# Altium project Pneumatics_Board.PrjPcb
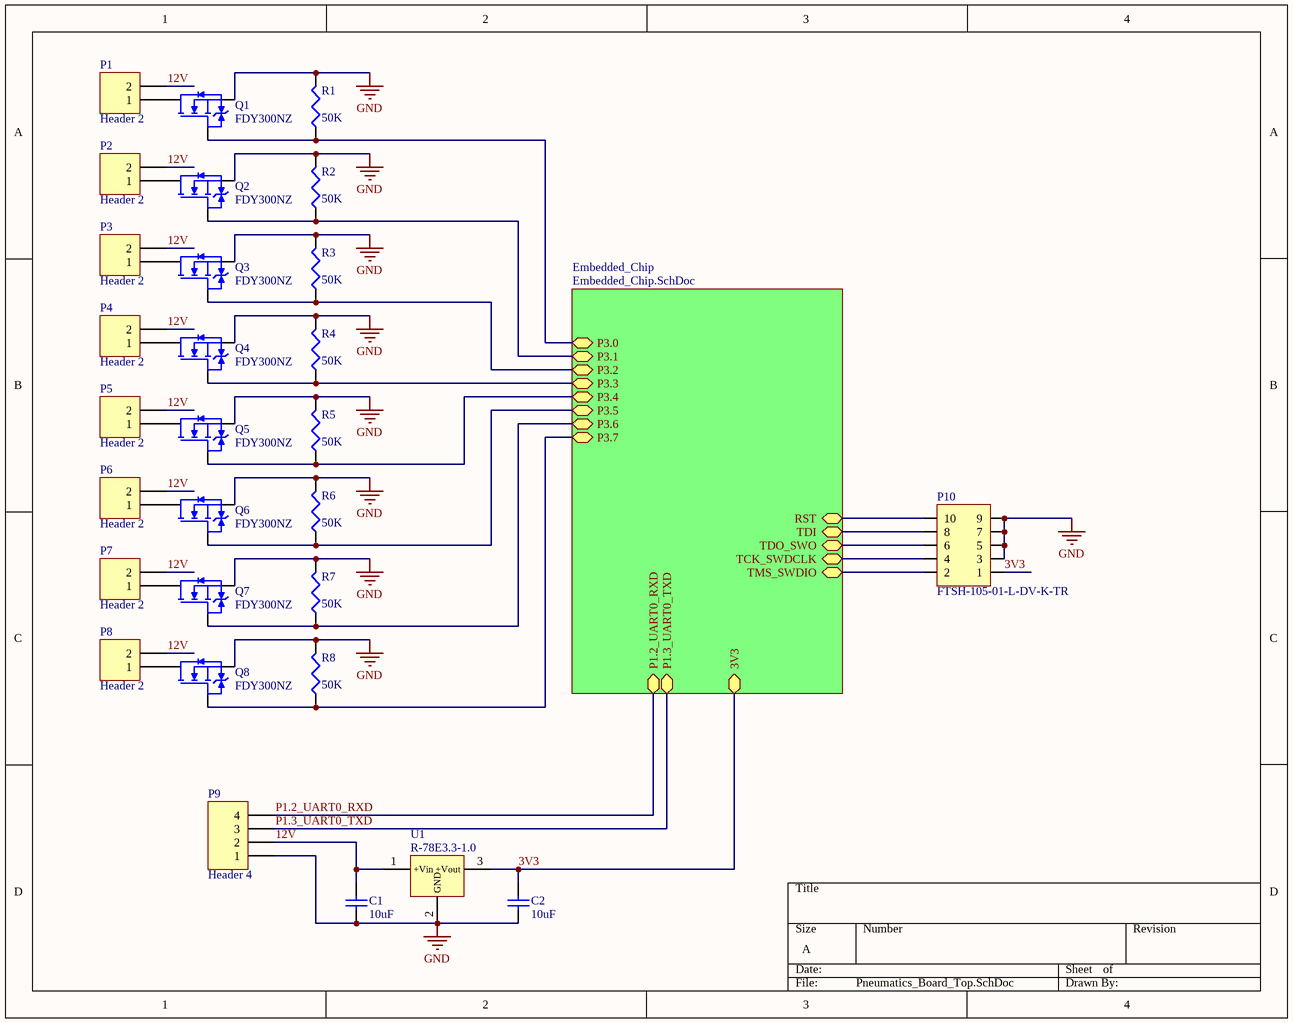
[diagram p0: Pneumatics_Board_Top.SchDoc]
2 sheets, 53 parts. Net scope: hierarchical (ports join the sheet entries above them; power ports are global).
Board file: Pneumatics_Board.PcbDoc
Sheets:
  Pneumatics_Board_Top.SchDoc
    Embedded_Chip = Embedded_Chip.SchDoc

## Sheet Pneumatics_Board_Top.SchDoc
size A

### Parts
C1  value 10uF  [C1206]  (hidden comment: Cap Semi)
C2  value 10uF  [C1206]  (hidden comment: Cap Semi)
P1  Header 2  [HDR1X2]
P2  Header 2  [HDR1X2]
P3  Header 2  [HDR1X2]
P4  Header 2  [HDR1X2]
P5  Header 2  [HDR1X2]
P6  Header 2  [HDR1X2]
P7  Header 2  [HDR1X2]
P8  Header 2  [HDR1X2]
P9  Header 4  [HDR1X4]
P10  FTSH-105-01-L-DV-K-TR  [FTSH-105-01-L-DV-K-TR]
Q1  FDY300NZ  [FDY300NZ]
Q2  FDY300NZ  [FDY300NZ]
Q3  FDY300NZ  [FDY300NZ]
Q4  FDY300NZ  [FDY300NZ]
Q5  FDY300NZ  [FDY300NZ]
Q6  FDY300NZ  [FDY300NZ]
Q7  FDY300NZ  [FDY300NZ]
Q8  FDY300NZ  [FDY300NZ]
R1  value 50K  [J1-0603]  (hidden comment: Res3)
R2  value 50K  [J1-0603]  (hidden comment: Res3)
R3  value 50K  [J1-0603]  (hidden comment: Res3)
R4  value 50K  [J1-0603]  (hidden comment: Res3)
R5  value 50K  [J1-0603]  (hidden comment: Res3)
R6  value 50K  [J1-0603]  (hidden comment: Res3)
R7  value 50K  [J1-0603]  (hidden comment: Res3)
R8  value 50K  [J1-0603]  (hidden comment: Res3)
U1  R-78E3.3-1.0  [R-78Exx-1.0]

### Sub-sheets
Embedded_Chip = Embedded_Chip.SchDoc: 3V3, TMS_SWDIO, TCK_SWDCLK, TDO_SWO, TDI, RST, P3.0, P3.1, P3.2, P3.3, P3.4, P3.5, P3.6, P3.7, P1.2_UART0_RXD, P1.3_UART0_TXD

### Nets
GND: C1.1 C2.1 P9.1 P10.3 P10.5 P10.7 P10.9 Q1.2(Source) Q2.2(Source) Q3.2(Source) Q4.2(Source) Q5.2(Source) Q6.2(Source) Q7.2(Source) Q8.2(Source) R1.2 R2.2 R3.2 R4.2 R5.2 R6.2 R7.2 R8.2 U1.2(GND)
3V3: C2.2 P10.1 U1.3(+Vout) ; sheet Embedded_Chip/3V3
12V: C1.2 P1.2 P2.2 P3.2 P4.2 P5.2 P6.2 P7.2 P8.2 P9.2 U1.1(+Vin)
P1.2_UART0_RXD: P9.4 ; sheet Embedded_Chip/P1.2_UART0_RXD
P1.3_UART0_TXD: P9.3 ; sheet Embedded_Chip/P1.3_UART0_TXD
P3.0: Q1.1(Gate) R1.1 ; sheet Embedded_Chip/P3.0
P3.1: Q2.1(Gate) R2.1 ; sheet Embedded_Chip/P3.1
P3.2: Q3.1(Gate) R3.1 ; sheet Embedded_Chip/P3.2
P3.3: Q4.1(Gate) R4.1 ; sheet Embedded_Chip/P3.3
P3.4: Q5.1(Gate) R5.1 ; sheet Embedded_Chip/P3.4
P3.5: Q6.1(Gate) R6.1 ; sheet Embedded_Chip/P3.5
P3.6: Q7.1(Gate) R7.1 ; sheet Embedded_Chip/P3.6
P3.7: Q8.1(Gate) R8.1 ; sheet Embedded_Chip/P3.7
RST: P10.10 ; sheet Embedded_Chip/RST
TCK_SWDCLK: P10.4 ; sheet Embedded_Chip/TCK_SWDCLK
TDI: P10.8 ; sheet Embedded_Chip/TDI
TDO_SWO: P10.6 ; sheet Embedded_Chip/TDO_SWO
TMS_SWDIO: P10.2 ; sheet Embedded_Chip/TMS_SWDIO
NetP1_1: P1.1 Q1.3(Drain)
NetP2_1: P2.1 Q2.3(Drain)
NetP3_1: P3.1 Q3.3(Drain)
NetP4_1: P4.1 Q4.3(Drain)
NetP5_1: P5.1 Q5.3(Drain)
NetP6_1: P6.1 Q6.3(Drain)
NetP7_1: P7.1 Q7.3(Drain)
NetP8_1: P8.1 Q8.3(Drain)

### Library data of the parts
C1 C2 = Cap Semi: Capacitor (Semiconductor SIM Model); Published: 8-Jun-2000; LatestRevisionDate: 29-May-2009; LatestRevisionNote: IPC-7351 Footprint Added.; PackageReference: C1206; Publisher: Altium Limited; PackageDescription: Chip Capacitor
P1-P8 = Header 2: Header, 2-Pin; LatestRevisionDate: 17-Jul-2002; LatestRevisionNote: Re-released for DXP Platform.; Publisher: Altium Limited
P9 = Header 4: Header, 4-Pin; LatestRevisionDate: 17-Jul-2002; LatestRevisionNote: Re-released for DXP Platform.; Publisher: Altium Limited
P10 = JTAG Header: CONN HEADER 10POS DUAL .05" SMD; Digikey Link: https://www.digikey.com/product-detail/en/samtec-inc/FTSH-105-01-L-DV-K-TR/SAM13165CT-ND/8827920; Drawings: http://suddendocs.samtec.com/prints/ftsh-1xx-xx-xxx-dv-xxx-xxx-mkt.pdf; Datasheet: http://suddendocs.samtec.com/catalog_english/ftsh_smt.pdf
Q1-Q8 = FDY300NZ: N-Channel 20V 600mA (Ta) 625mW (Ta) Surface Mount SC-89-3; Digikey: https://www.digikey.com/product-detail/en/on-semiconductor/FDY300NZ/FDY300NZCT-ND/1923099; Datasheet: https://www.fairchildsemi.com/datasheets/FD/FDY300NZ.pdf
R1-R8 = Res3: Resistor; Published: 8-Jun-2000; LatestRevisionDate: 29-May-2009; LatestRevisionNote: IPC-7351 Footprint Added.; PackageReference: J1-0603; Publisher: Altium Limited; PackageDescription: Chip Resistor
U1 = R-78Exx-1.0: 1A DC/DC Voltage Converter; Datasheet: https://www.recom-power.com/pdf/Innoline/R-78Exx-1.0.pdf; Digikey: https://www.digikey.com/product-detail/en/recom-power/R-78E3.3-1.0/945-2409-5-ND/5327711

## Sheet Embedded_Chip.SchDoc
size A
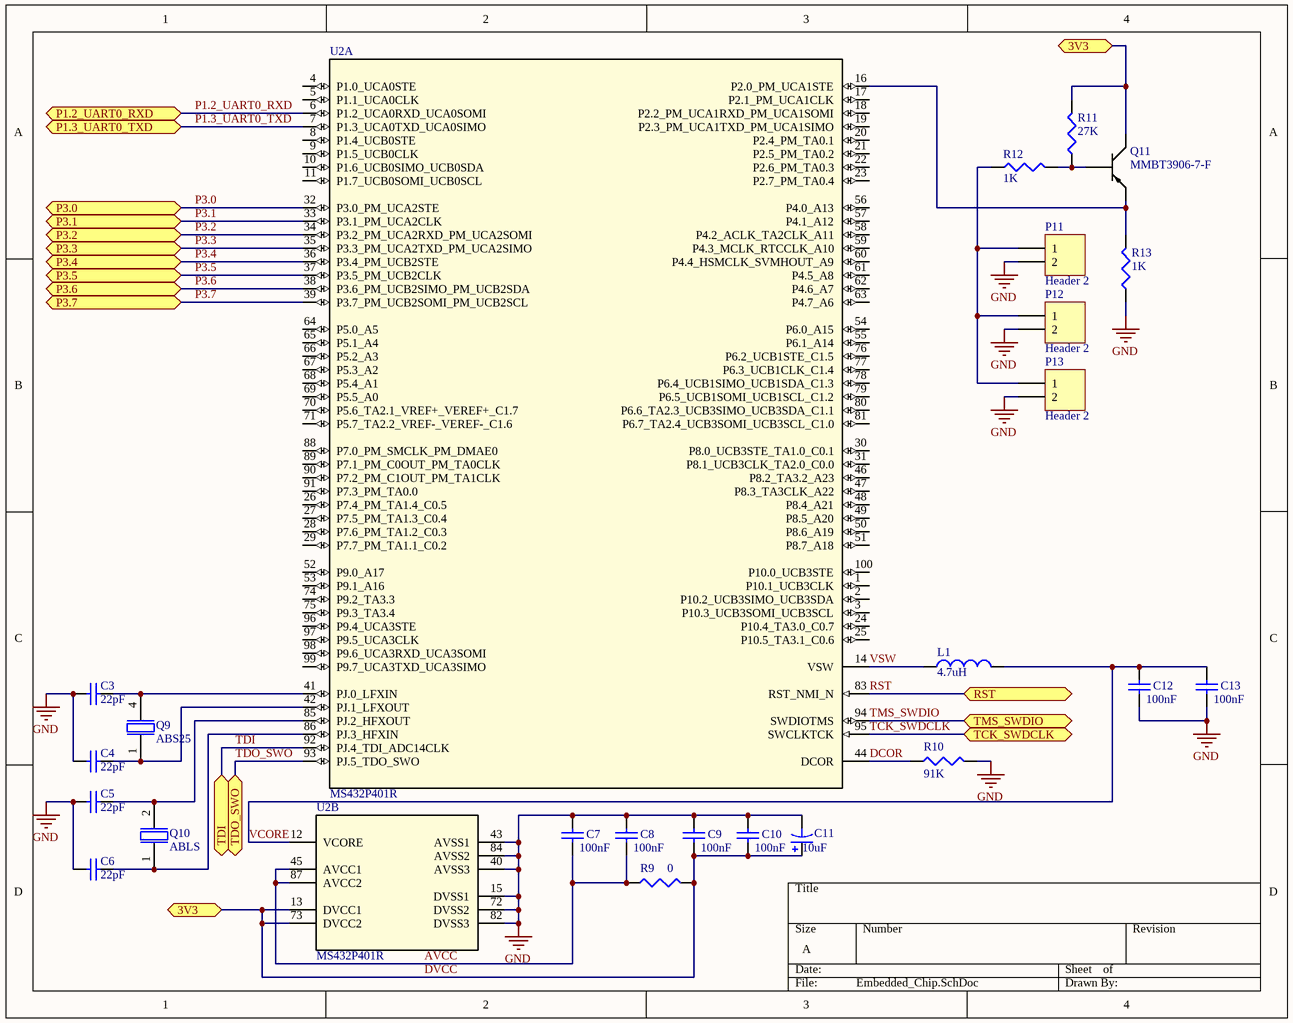
[diagram p1: Embedded_Chip.SchDoc]

### Parts
C3  value 22pF  [C1206]  (hidden comment: Cap Semi)
C4  value 22pF  [C1206]  (hidden comment: Cap Semi)
C5  value 22pF  [C1206]  (hidden comment: Cap Semi)
C6  value 22pF  [C1206]  (hidden comment: Cap Semi)
C7  value 100nF  [C1206]  (hidden comment: Cap Semi)
C8  value 100nF  [C1206]  (hidden comment: Cap Semi)
C9  value 100nF  [C1206]  (hidden comment: Cap Semi)
C10  value 100nF  [C1206]  (hidden comment: Cap Semi)
C11  value 10uF  [CAPAE5043X55M]  (hidden comment: Cap Pol3)
C12  value 100nF  [C1206]  (hidden comment: Cap Semi)
C13  value 100nF  [C1206]  (hidden comment: Cap Semi)
L1  value 4.7uH  [0806 (Metric 2016)]  (hidden comment: Inductor)
P11  Header 2  [HDR1X2]
P12  Header 2  [HDR1X2]
P13  Header 2  [HDR1X2]
Q9  ABS25  [ABS25]
Q10  ABLS  [ABLS]
Q11  MMBT3906-7-F  [MMBT3906-7-F]
R9  value 0  [J1-0603]  (hidden comment: Res3)
R10  value 91K  [J1-0603]  (hidden comment: Res3)
R11  value 27K  [J1-0603]  (hidden comment: Res3)
R12  value 1K  [J1-0603]  (hidden comment: Res3)
R13  value 1K  [J1-0603]  (hidden comment: Res3)
U2  MS432P401R  [PZ0100A_M]  (parts A,B of 2)

### Ports
3V3, P1.2_UART0_RXD, P1.3_UART0_TXD, P3.0, P3.1, P3.2, P3.3, P3.4, P3.5, P3.6, P3.7, RST, TCK_SWDCLK, TDI, TDO_SWO, TMS_SWDIO

### Nets
GND: C3.1 C4.1 C5.1 C6.1 C7.2 C8.2 C9.2 C10.2 C11.2 C12.1 C13.1 P11.2 P12.2 P13.2 R10.2 R13.1 U2.15(DVSS1) U2.40(AVSS3) U2.43(AVSS1) U2.72(DVSS2) U2.82(DVSS3) U2.84(AVSS2)
AVCC: C7.1 C8.1 R9.1 U2.45(AVCC1) U2.87(AVCC2)
DCOR: R10.1 U2.44(DCOR)
DVCC: C9.1 C10.1 C11.1 Q11.C(Collector) R9.2 R11.2 U2.13(DVCC1) U2.73(DVCC2) ; port 3V3  [project net 3V3]
P1.2_UART0_RXD: U2.6(P1.2_UCA0RXD_UCA0SOMI) ; port P1.2_UART0_RXD
P1.3_UART0_TXD: U2.7(P1.3_UCA0TXD_UCA0SIMO) ; port P1.3_UART0_TXD
P3.0: U2.32(P3.0_PM_UCA2STE) ; port P3.0
P3.1: U2.33(P3.1_PM_UCA2CLK) ; port P3.1
P3.2: U2.34(P3.2_PM_UCA2RXD_PM_UCA2SOMI) ; port P3.2
P3.3: U2.35(P3.3_PM_UCA2TXD_PM_UCA2SIMO) ; port P3.3
P3.4: U2.36(P3.4_PM_UCB2STE) ; port P3.4
P3.5: U2.37(P3.5_PM_UCB2CLK) ; port P3.5
P3.6: U2.38(P3.6_PM_UCB2SIMO_PM_UCB2SDA) ; port P3.6
P3.7: U2.39(P3.7_PM_UCB2SOMI_PM_UCB2SCL) ; port P3.7
RST: U2.83(RST_NMI_N) ; port RST
TCK_SWDCLK: U2.95(SWCLKTCK) ; port TCK_SWDCLK
TDI: U2.92(PJ.4_TDI_ADC14CLK) ; port TDI
TDO_SWO: U2.93(PJ.5_TDO_SWO) ; port TDO_SWO
TMS_SWDIO: U2.94(SWDIOTMS) ; port TMS_SWDIO
VCORE: C12.2 C13.2 L1.2 U2.12(VCORE)
VSW: L1.1 U2.14(VSW)
NetC3_2: C3.2 Q9.4 U2.41(PJ.0_LFXIN)
NetC4_2: C4.2 Q9.1 U2.42(PJ.1_LFXOUT)
NetC5_2: C5.2 Q10.2 U2.85(PJ.2_HFXOUT)
NetC6_2: C6.2 Q10.1 U2.86(PJ.3_HFXIN)
NetP11_1: P11.1 P12.1 P13.1 R12.1
NetQ11_B: Q11.B(Body) R11.1 R12.2
NetQ11_E: Q11.E(Emitter) R13.2 U2.16(P2.0_PM_UCA1STE)

Not connected (* = marked no-connect by the designer): U2 1(P10.1_UCB3CLK) 2(P10.2_UCB3SIMO_UCB3SDA) 3(P10.3_UCB3SOMI_UCB3SCL) 4(P1.0_UCA0STE) 5(P1.1_UCA0CLK) 8(P1.4_UCB0STE) 9(P1.5_UCB0CLK) 10(P1.6_UCB0SIMO_UCB0SDA) 11(P1.7_UCB0SOMI_UCB0SCL) 17(P2.1_PM_UCA1CLK) 18(P2.2_PM_UCA1RXD_PM_UCA1SOMI) 19(P2.3_PM_UCA1TXD_PM_UCA1SIMO) 20(P2.4_PM_TA0.1) 21(P2.5_PM_TA0.2) 22(P2.6_PM_TA0.3) 23(P2.7_PM_TA0.4) 24(P10.4_TA3.0_C0.7) 25(P10.5_TA3.1_C0.6) 26(P7.4_PM_TA1.4_C0.5) 27(P7.5_PM_TA1.3_C0.4) 28(P7.6_PM_TA1.2_C0.3) 29(P7.7_PM_TA1.1_C0.2) 30(P8.0_UCB3STE_TA1.0_C0.1) 31(P8.1_UCB3CLK_TA2.0_C0.0) 46(P8.2_TA3.2_A23) 47(P8.3_TA3CLK_A22) 48(P8.4_A21) 49(P8.5_A20) 50(P8.6_A19) 51(P8.7_A18) 52(P9.0_A17) 53(P9.1_A16) 54(P6.0_A15) 55(P6.1_A14) 56(P4.0_A13) 57(P4.1_A12) 58(P4.2_ACLK_TA2CLK_A11) 59(P4.3_MCLK_RTCCLK_A10) 60(P4.4_HSMCLK_SVMHOUT_A9) 61(P4.5_A8) 62(P4.6_A7) 63(P4.7_A6) 64(P5.0_A5) 65(P5.1_A4) 66(P5.2_A3) 67(P5.3_A2) 68(P5.4_A1) 69(P5.5_A0) 70(P5.6_TA2.1_VREF+_VEREF+_C1.7) 71(P5.7_TA2.2_VREF-_VEREF-_C1.6) 74(P9.2_TA3.3) 75(P9.3_TA3.4) 76(P6.2_UCB1STE_C1.5) 77(P6.3_UCB1CLK_C1.4) 78(P6.4_UCB1SIMO_UCB1SDA_C1.3) 79(P6.5_UCB1SOMI_UCB1SCL_C1.2) 80(P6.6_TA2.3_UCB3SIMO_UCB3SDA_C1.1) 81(P6.7_TA2.4_UCB3SOMI_UCB3SCL_C1.0) 88(P7.0_PM_SMCLK_PM_DMAE0) 89(P7.1_PM_C0OUT_PM_TA0CLK) 90(P7.2_PM_C1OUT_PM_TA1CLK) 91(P7.3_PM_TA0.0) 96(P9.4_UCA3STE) 97(P9.5_UCA3CLK) 98(P9.6_UCA3RXD_UCA3SOMI) 99(P9.7_UCA3TXD_UCA3SIMO) 100(P10.0_UCB3STE)

### Library data of the parts
C3-C10 C12 C13 = Cap Semi: Capacitor (Semiconductor SIM Model); Published: 8-Jun-2000; LatestRevisionDate: 29-May-2009; LatestRevisionNote: IPC-7351 Footprint Added.; PackageReference: C1206; Publisher: Altium Limited; PackageDescription: Chip Capacitor
C11 = Cap Pol3: 10µF 10V Aluminum Electrolytic Capacitors Radial, Can - SMD 1000 Hrs @ 85°C; Digikey: https://www.digikey.com/product-detail/en/wurth-electronics-inc/865090240001/732-8394-1-ND/5728351
L1 = Inductor: Code_IEC: 1005; Published: 8-Jun-2000; LatestRevisionDate: 29-May-2009; LatestRevisionNote: IPC-7351 Footprint Added.; PackageReference: 0402-A; Publisher: Altium Limited; PackageDescription: Chip Inductor; Code_JEITA: 0402; Supplier 1: Digi-Key; Supplier Part Number 1: 732-2956-1-ND
P11-P13 = Header 2: Header, 2-Pin; LatestRevisionDate: 17-Jul-2002; LatestRevisionNote: Re-released for DXP Platform.; Publisher: Altium Limited
Q9 = ABS25: 32.768 kHz Low Frequency SMD Crystal; Datasheet: https://abracon.com/Resonators/abs25.pdf
Q10 = ABLS: SMD Low Profile Crystal - 3.579545 MHz to 75 MHz; Datasheet: https://abracon.com/Resonators/abls.pdf
Q11 = MMBT3906-7-F: TRANS PNP 40V 0.2A SOT23-3; Datasheet: https://media.digikey.com/pdf/Data%20Sheets/Diodes%20PDFs/MMBT3906.pdf; Digikey: https://www.digikey.com/product-detail/en/diodes-incorporated/MMBT3906-7-F/MMBT3906-FDICT-ND/822858
R9-R13 = Res3: Resistor; Published: 8-Jun-2000; LatestRevisionDate: 29-May-2009; LatestRevisionNote: IPC-7351 Footprint Added.; PackageReference: J1-0603; Publisher: Altium Limited; PackageDescription: Chip Resistor
U2 = MS432P401R-IPZR: SimpleLink Ultra-Low-Power 32-Bit ARM Cortex-M4F MCU With Precision ADC, 256KB Flash and 64KB RAM; PartNumber: XMS432P401RIPZR; Manufacturer: Texas Instruments; CompType: IC; PIN_COUNT: 100; PackageReference: PZ0100A; MountType: SMT; RefDes: RefDes; TYPE: TYPE; Value: Value

## Nets that join several sheets
GND: Pneumatics_Board_Top (24 pins), Embedded_Chip (22 pins)
3V3: Pneumatics_Board_Top (C2.2 P10.1 U1.3), Embedded_Chip (8 pins)
P1.2_UART0_RXD: Pneumatics_Board_Top (P9.4), Embedded_Chip (U2.6)
P1.3_UART0_TXD: Pneumatics_Board_Top (P9.3), Embedded_Chip (U2.7)
P3.0: Pneumatics_Board_Top (Q1.1 R1.1), Embedded_Chip (U2.32)
P3.1: Pneumatics_Board_Top (Q2.1 R2.1), Embedded_Chip (U2.33)
P3.2: Pneumatics_Board_Top (Q3.1 R3.1), Embedded_Chip (U2.34)
P3.3: Pneumatics_Board_Top (Q4.1 R4.1), Embedded_Chip (U2.35)
P3.4: Pneumatics_Board_Top (Q5.1 R5.1), Embedded_Chip (U2.36)
P3.5: Pneumatics_Board_Top (Q6.1 R6.1), Embedded_Chip (U2.37)
P3.6: Pneumatics_Board_Top (Q7.1 R7.1), Embedded_Chip (U2.38)
P3.7: Pneumatics_Board_Top (Q8.1 R8.1), Embedded_Chip (U2.39)
RST: Pneumatics_Board_Top (P10.10), Embedded_Chip (U2.83)
TCK_SWDCLK: Pneumatics_Board_Top (P10.4), Embedded_Chip (U2.95)
TDI: Pneumatics_Board_Top (P10.8), Embedded_Chip (U2.92)
TDO_SWO: Pneumatics_Board_Top (P10.6), Embedded_Chip (U2.93)
TMS_SWDIO: Pneumatics_Board_Top (P10.2), Embedded_Chip (U2.94)